# Altium schematic sheet CM5_HighSpeed.SchDoc
size A4; SheetNumber: 3; SheetTotal: 3
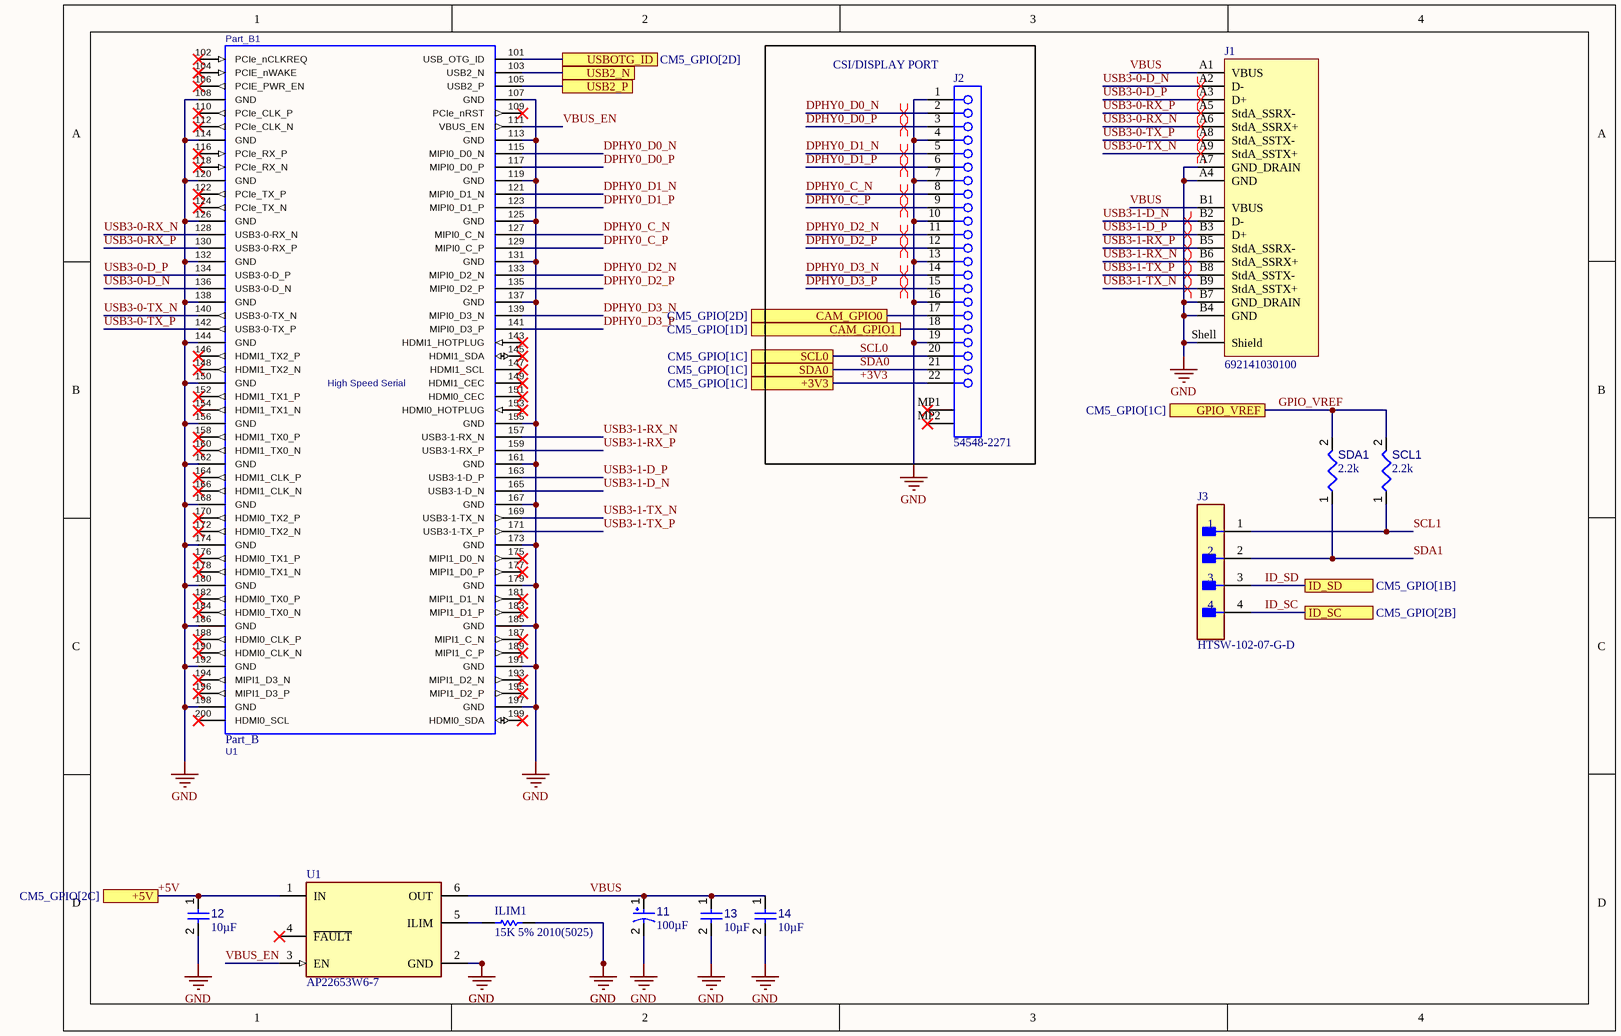
[diagram p0: CM5_HighSpeed.SchDoc]

## Parts
11  value 100µF  [AVX-TAJ-C-2_M]  (hidden comment: TAJC107K016RNJ)
12  value 10µF  [CAPC0805(2012)145_L]  (hidden comment: Capacitor 10µF +/-20% 25V 0805)
13  value 10µF  [CAPC0805(2012)145_L]  (hidden comment: Capacitor 10µF +/-20% 25V 0805)
14  value 10µF  [CAPC0805(2012)145_L]  (hidden comment: Capacitor 10µF +/-20% 25V 0805)
ILIM1  15K 5% 2010(5025)  [RESC2010(5025)_L]
J1  692141030100  [692141030100]
J2  54548-2271  [MOLX-54548-2271]
J3  HTSW-102-07-G-D  [FP-HTSW-102-07-G-D-MFG]
Part_B1  Part_B  Reference: U1  [AMPHENOL_10164227-1004A1RLF]
SCL1  value 2.2k  [RESC0402(1005)_L]  (hidden comment: Resistor 2K2  +/-5 % 0402 63 mW)
SDA1  value 2.2k  [RESC0402(1005)_L]  (hidden comment: Resistor 2K2  +/-5 % 0402 63 mW)
U1  AP22653W6-7  [FP-SOT26-MFG]

## Blocks framed on the sheet
CSI/DISPLAY PORT: J2

## Ports
+3V3 (see CM5_GPIO[1C]), +5V (see CM5_GPIO[2C]), CAM_GPIO0 (see CM5_GPIO[2D]), CAM_GPIO1 (see CM5_GPIO[1D]), GPIO_VREF (see CM5_GPIO[1C]), ID_SC (see CM5_GPIO[2B]), ID_SD (see CM5_GPIO[1B]), SCL0 (see CM5_GPIO[1C]), SDA0 (see CM5_GPIO[1C]), USB2_N, USB2_P, USBOTG_ID (see CM5_GPIO[2D])

## Nets
GND: 11.2 12.2 13.2 14.2 ILIM1.2 J1.A4(GND) J1.A7(GND_DRAIN) J1.B4(GND) J1.B7(GND_DRAIN) J1.Shell(Shield) J2.1 J2.4 J2.7 J2.10 J2.13 J2.16 J2.19 Part_B1.107(GND) Part_B1.108(GND) Part_B1.113(GND) Part_B1.114(GND) Part_B1.119(GND) Part_B1.120(GND) Part_B1.125(GND) Part_B1.126(GND) Part_B1.131(GND) Part_B1.132(GND) Part_B1.137(GND) Part_B1.138(GND) Part_B1.144(GND) Part_B1.150(GND) Part_B1.155(GND) Part_B1.156(GND) Part_B1.161(GND) Part_B1.162(GND) Part_B1.167(GND) Part_B1.168(GND) Part_B1.173(GND) Part_B1.174(GND) Part_B1.179(GND) Part_B1.180(GND) Part_B1.185(GND) Part_B1.186(GND) Part_B1.191(GND) Part_B1.192(GND) Part_B1.197(GND) Part_B1.198(GND) U1.2(GND)
+3V3: J2.22 ; port +3V3
+5V: 12.1 U1.1(IN) ; port +5V
CAM_GPIO0: J2.17 ; port CAM_GPIO0
CAM_GPIO1: J2.18 ; port CAM_GPIO1
DPHY0_C_N: J2.8 Part_B1.127(MIPI0_C_N)
DPHY0_C_P: J2.9 Part_B1.129(MIPI0_C_P)
DPHY0_D0_N: J2.2 Part_B1.115(MIPI0_D0_N)
DPHY0_D0_P: J2.3 Part_B1.117(MIPI0_D0_P)
DPHY0_D1_N: J2.5 Part_B1.121(MIPI0_D1_N)
DPHY0_D1_P: J2.6 Part_B1.123(MIPI0_D1_P)
DPHY0_D2_N: J2.11 Part_B1.133(MIPI0_D2_N)
DPHY0_D2_P: J2.12 Part_B1.135(MIPI0_D2_P)
DPHY0_D3_N: J2.14 Part_B1.139(MIPI0_D3_N)
DPHY0_D3_P: J2.15 Part_B1.141(MIPI0_D3_P)
GPIO_VREF: SCL1.2 SDA1.2 ; port GPIO_VREF
ID_SC: J3.4 ; port ID_SC
ID_SD: J3.3 ; port ID_SD
SCL0: J2.20 ; port SCL0
SCL1: J3.1 SCL1.1
SDA0: J2.21 ; port SDA0
SDA1: J3.2 SDA1.1
USB2_N: Part_B1.103(USB2_N) ; port USB2_N
USB2_P: Part_B1.105(USB2_P) ; port USB2_P
USB3-0-D_N: J1.A2(D-) Part_B1.136(USB3-0-D_N)
USB3-0-D_P: J1.A3(D+) Part_B1.134(USB3-0-D_P)
USB3-0-RX_N: J1.A6(StdA_SSRX+) Part_B1.128(USB3-0-RX_N)
USB3-0-RX_P: J1.A5(StdA_SSRX-) Part_B1.130(USB3-0-RX_P)
USB3-0-TX_N: J1.A9(StdA_SSTX+) Part_B1.140(USB3-0-TX_N)
USB3-0-TX_P: J1.A8(StdA_SSTX-) Part_B1.142(USB3-0-TX_P)
USB3-1-D_N: J1.B2(D-) Part_B1.165(USB3-1-D_N)
USB3-1-D_P: J1.B3(D+) Part_B1.163(USB3-1-D_P)
USB3-1-RX_N: J1.B6(StdA_SSRX+) Part_B1.157(USB3-1-RX_N)
USB3-1-RX_P: J1.B5(StdA_SSRX-) Part_B1.159(USB3-1-RX_P)
USB3-1-TX_N: J1.B9(StdA_SSTX+) Part_B1.169(USB3-1-TX_N)
USB3-1-TX_P: J1.B8(StdA_SSTX-) Part_B1.171(USB3-1-TX_P)
USBOTG_ID: Part_B1.101(USB_OTG_ID) ; port USBOTG_ID
VBUS: 11.1 13.1 14.1 J1.A1(VBUS) J1.B1(VBUS) U1.6(OUT)
VBUS_EN: Part_B1.111(VBUS_EN) U1.3(EN)
NetILIM1_1: ILIM1.1 U1.5(ILIM)

Not connected (* = marked no-connect by the designer): J2 MP1* MP2*; Part_B1 102(PCIe_nCLKREQ)* 104(PCIE_nWAKE)* 106(PCIE_PWR_EN)* 109(PCIe_nRST)* 110(PCIe_CLK_P)* 112(PCIe_CLK_N)* 116(PCIe_RX_P)* 118(PCIe_RX_N)* 122(PCIe_TX_P)* 124(PCIe_TX_N)* 143(HDMI1_HOTPLUG)* 145(HDMI1_SDA)* 146(HDMI1_TX2_P)* 147(HDMI1_SCL)* 148(HDMI1_TX2_N)* 149(HDMI1_CEC)* 151(HDMI0_CEC)* 152(HDMI1_TX1_P)* 153(HDMI0_HOTPLUG)* 154(HDMI1_TX1_N)* 158(HDMI1_TX0_P)* 160(HDMI1_TX0_N)* 164(HDMI1_CLK_P)* 166(HDMI1_CLK_N)* 170(HDMI0_TX2_P)* 172(HDMI0_TX2_N)* 175(MIPI1_D0_N)* 176(HDMI0_TX1_P)* 177(MIPI1_D0_P)* 178(HDMI0_TX1_N)* 181(MIPI1_D1_N)* 182(HDMI0_TX0_P)* 183(MIPI1_D1_P)* 184(HDMI0_TX0_N)* 187(MIPI1_C_N)* 188(HDMI0_CLK_P)* 189(MIPI1_C_P)* 190(HDMI0_CLK_N)* 193(MIPI1_D2_N)* 194(MIPI1_D3_N)* 195(MIPI1_D2_P)* 196(MIPI1_D3_P)* 199(HDMI0_SDA)* 200(HDMI0_SCL)*; U1 4(~{FAULT})*

## Layout directives
differential pair: DPHY0_C_N, DPHY0_C_P, DPHY0_D0_N, DPHY0_D0_P, DPHY0_D1_N, DPHY0_D1_P, DPHY0_D2_N, DPHY0_D2_P, DPHY0_D3_N, DPHY0_D3_P, USB3-0-D_N, USB3-0-D_P, USB3-0-RX_N, USB3-0-RX_P, USB3-0-TX_N, USB3-0-TX_P, USB3-1-D_N, USB3-1-D_P, USB3-1-RX_N, USB3-1-RX_P, USB3-1-TX_N, USB3-1-TX_P

## Notes on the sheet
- (in symbol Part_B) High Speed Serial

## Library data of the parts
11 = CMP-001-00046-7: Standard Tantalum, 100 uF, +/- 10%, 16 V, -55 to 125 degC, 2312 (6032 Metric), RoHS, Tape and Reel; Manufacturer: AVX; ESR: 1Ohm; Voltage Rating: 16V; Max Operating Temperature: 125°C; Package Description: 2-Pin Surface Mount Device, Body 6 x 3.25 mm; Datasheet Version: Feb-16; Packaging: TapeandReel; RoHS Compliant: True; Datasheet URL: http://datasheets.avx.com/TAJ.pdf; Case/Package: 2412; Package Quantity: 500; Package Reference: TAJ-C-2; Min Operating Temperature: -55°C; Capacitor Type: Tantalum; Resistance: 1Ohm; Tolerance: 10%; Manufacturer URL: http://www.avx.com/; Mounting Technology: SM
12-14 = CMP-001-00079-4: Chip Capacitor, 10µF +/-20%, 25V, 0805, Thickness 1.45 mm; Tolerance: 10%; Max Operating Temperature: 85°C; Case/Package: 0805; Voltage Rating: 25V; Min Operating Temperature: -55°C; Mounting Technology: SMT; Pins: 2
ILIM1 = CMP-1017-00102-1: 15K 0.75W 5% 2010 (5025 Metric)  SMD; Case-Metric: 5025; Value: 15000.00 Ohm; Case-EIA: 2010; Technology: SMT; Tolerance: 5 %; Power: 0.75 W
J1 = CMP-1502-03222-4: Wr-com, Right Angle Version 3.0; Connector, Through Hole Socket, 30 V, 250MA; Gender: Receptacle; Voltage Rating (AC): 30V; Number of Ports: 2; Connector Type: USB; USB Standard: USB 3.0; Contact Resistance: 50mΩ; Insulation Resistance: 100MΩ; Number of Contacts: 18; Min Operating Temperature: -40°C; REACH SVHC: Unknown; Features: Shielded; Contact Plating: Gold; Max Operating Temperature: 85°C; Current Rating: 250mA; Length: 15.59mm; Orientation: Right Angle; Voltage Rating: 30V; Contact Material: Gold, Nickel; Operating Supply Voltage: 30V; Lead Free: Lead Free; Termination: Through Hole; Number of Pins: 18; Mount: Horizontal, Through Hole; Color: Blue; Flammability Rating: UL94 V-0; Height: 16.335mm; Width: 19.7mm; RoHS: Compliant
J2 = CMP-1241-00555-1: 0.5 mm Pitch Easy-On(TM) Type FPC Connector, 1.2 mm Mated Height, Right Angle, ZIF, SMT, Bottom Contact, 22 Circuits, -20 to 85 degC, ELV and RoHS Compliant, Tape and Reel; Manufacturer: Molex; Circuits (Loaded): 22; Stackable: No; Material - Plating Termination: Tin; PCB Retention: Yes; Entry Angle: 90degrees Angle; Material - Plating Mating: Gold; Current (Max per Contact): 0.5A; Material - Metal: Phosphor Bronze; Voltage (Max): 50V; Mated Height: 1.20mm; Pitch - Mating Interface: 0.50mm; Durability (mating cycles max): 20; PackageVersion: Rev. N, 06/2008; PackageDescription: 22-Lead FPC Connector, Pitch 0.5 mm; PackageReference: 54548-2271; ComponentLink2Description: Datasheet; PartNumber: 54548-2271; ComponentLink3URL: http://www.molex.com/pdm_docs/sd/545482171_sd.pdf; Contact Position: Bottom; Packing: Tape and Reel; ComponentLink1URL: http://www.molex.com/molex/index.jsp; Mounting Technology: Surface Mount; ComponentLink3Description: Package Specification; PCB Locator: No; ComponentLink2URL: http://www.molex.com/webdocs/datasheets/pdf/en-us/0545482271_FFC_FPC_CONNECTORS.pdf; Orientation: Right Angle; Number of Rows: 1; RoHS: TRUE; Polarized to PCB: Yes; ComponentLink1Description: Manufacturer URL
J3 = CMP-02766-000010-1: CONN HEADER VERT 4POS 2.54MM; Manufacturer: Samtec; Voltage Rating: 550V; Conn Orientation: Straight; Number Of Contacts: 4; Conn Gender: Male; Current Rating: 6.3A; Number Of Rows: 2; Category: Conn; Temperature: -55°C to +125°C; Automotive: No; Digikey Description: CONN HEADER VERT 4POS 2.54MM; ComponentLink2URL: http://suddendocs.samtec.com/catalog_english/htsw_th.pdf; Device Class L2: Headers and Wire Housings; Mouser Description: Conn Unshrouded Header HDR 4 POS 2.54mm Solder ST Thru-Hole Bag; Manufacturer Part Number: HTSW-102-07-G-D; Temperature Range High: +125°C; Contact Material: Gold,Nickel; Temperature Range Low: -55°C; ComponentLink2Description: Datasheet; Device Class L1: Connectors; Pitch: 2.54mm; Octopart: https://octopart.com/htsw-102-07-g-d-samtec-10531767; RoHS: TRUE; Package: HTSW-102-07-G-D; Lead Free: Yes; Device Class L3: unset; Height: 8.71mm
Part_B1 = Part_B: pin to pad: 101>1 102>2 103>3 104>4 105>5 106>6 107>7 108>8 109>9 110>10 111>11 112>12 113>13 114>14 115>15 116>16 117>17 118>18 119>19 120>20 121>21 122>22 123>23 124>24 125>25 126>26 127>27 128>28 129>29 130>30 131>31 132>32 133>33 134>34 135>35 136>36 137>37 138>38 139>39 140>40 141>41 142>42 143>43 144>44 145>45 146>46 147>47 148>48 149>49 150>50 151>51 152>52 153>53 154>54 155>55 156>56 157>57 158>58 159>59 160>60 161>61 162>62 163>63 164>64 165>65 166>66 167>67 168>68 169>69 170>70 171>71 172>72 173>73 174>74 175>75 176>76 177>77 178>78 179>79 180>80 181>81 182>82 183>83 184>84 185>85 186>86 187>87 188>88 189>89 190>90 191>91 192>92 193>93 194>94 195>95 196>96 197>97 198>98 199>99 200>100
SCL1 SDA1 = CMP-009-00166-3: Chip Resistor, 2,2 kOhms, +/-5 %, 63 mW, -55 to 155 degC, 0402; Power: 63mW; Tolerance: 5%; Pins: 2; Min Operating Temperature: -55°C; Max Operating Temperature: 155°C; Case/Package: 0402
U1 = CMP-12749-000002-1: LOAD SWITCH,SOT26,T&R,3K